# EAGLE design keyless (EAGLE 6.5.0)
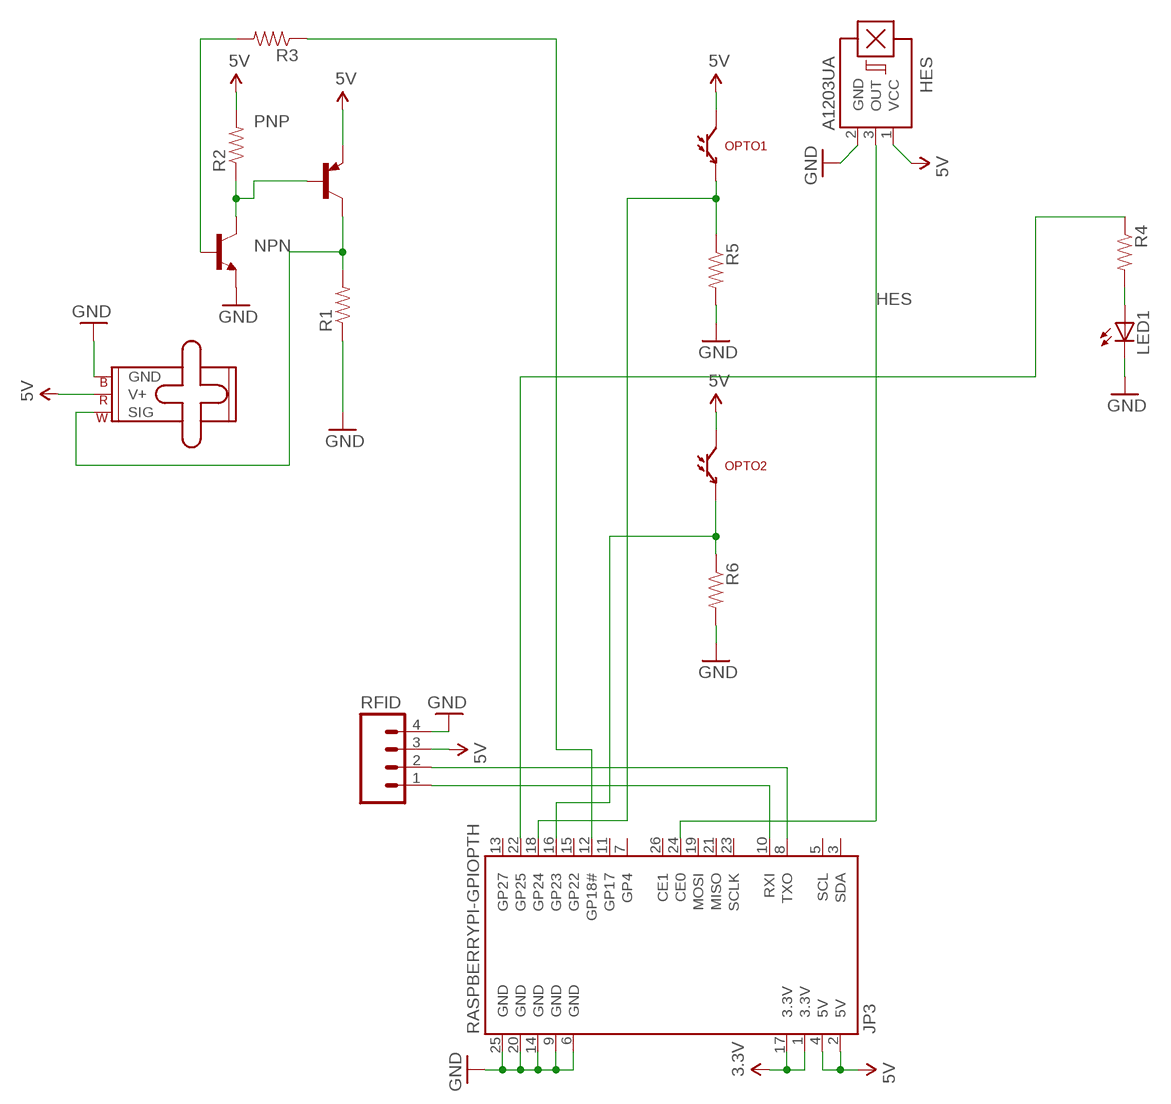
[diagram p0: schematic, sheet 1]

## Parts
HES  A1203UA  [SIP3-UA]
JP3  RASPBERRYPI-GPIOPTH  [2X13-SHROUDED]
LED1  LED5MM  [LED5MM]
NPN  TRANSISTOR_NPNTO-92-AMMO  [TO-92-AMMO]
OPTO1  LTR-301  [LTR-301]
OPTO2  LTR-301  [LTR-301]
PNP  -PNP-TO92-CEB  [TO92-CEB]
R1  RESISTORAXIAL-0.3  [AXIAL-0.3]
R2  RESISTORAXIAL-0.3  [AXIAL-0.3]
R3  RESISTORAXIAL-0.3  [AXIAL-0.3]
R4  RESISTORAXIAL-0.3  [AXIAL-0.3]
R5  RESISTORAXIAL-0.3  [AXIAL-0.3]
R6  RESISTORAXIAL-0.3  [AXIAL-0.3]
RFID  M04PTH  [1X04]
SERVO  SMALL_SERVO  [1X03]

## Nets
3.3V: JP3.1(3.3V) JP3.17(3.3V)
5V: HES.1(VCC) JP3.2(5V) JP3.4(5V) OPTO1.C OPTO2.C PNP.E R2.P$2 RFID.3 SERVO.2(V+)
GND: HES.2(GND) JP3.6(GND) JP3.9(GND) JP3.14(GND) JP3.20(GND) JP3.25(GND) LED1.K(C) NPN.1(E) R1.P$1 R5.P$2 R6.P$2 RFID.4
HES: HES.3(OUT) JP3.24(CE0)
N$1: NPN.3(C) PNP.B R2.P$1
N$2: JP3.12(GP18#) R3.P$1
N$3: PNP.C R1.P$2 SERVO.1(SIG)
N$4: NPN.2(B) R3.P$2
N$5: LED1.A R4.P$2
N$7: JP3.16(GP23) OPTO2.E R6.P$1
N$8: JP3.18(GP24) OPTO1.E R5.P$1
N$9: JP3.10(RXI) RFID.1
N$10: JP3.8(TXO) RFID.2
N$11: SERVO.3(GND)
N$13: JP3.22(GP25) R4.P$1
Unconnected: JP3.3(SDA) JP3.5(SCL) JP3.7(GP4) JP3.11(GP17) JP3.13(GP27) JP3.15(GP22) JP3.19(MOSI) JP3.21(MISO) JP3.23(SCLK) JP3.26(CE1)

## Library data of the parts
HES = allegro:A12*?: Hall-effect bipolar switch Source: http://www.allegromicro.com/en/Products/Part_Numbers/1202/1202.pdf; OC_FARNELL: 1521672; OC_NEWARK: unknown
JP3 = SparkFun-Boards:RASPBERRYPI-GPIO: RASPBERRY PI I/O HEADER As defined for the Revistion 2 Pi.; DIST: sparkfun; DIST_ID: PRT-11490
LED1 = led:LED: LED OSRAM: - CHIPLED LG R971, LG N971, LY N971, LG Q971, LY Q971, LO R971, LY R971 LH N974, LH R974 LS Q976, LO Q976, LY Q976 LO Q996 - Hyper CHIPLED LW Q18S LB Q993, LB Q99A, LB R99A - SideLED LS A670, LO A670, LY A670, LG A670, LP A670 LB A673, LV A673, LT A673, LW A673 LH A674 LY A675 LS A676, LA A676, LO A676, LY A676, LW A676 LS A679, LY A679, LG A679 - Hyper Micro SIDELED® LS Y876, LA Y876, LO Y876, LY Y876 LT Y87S - SmartLED LW L88C, LW L88S LB L89C, LB L89S, LG L890 LS L89K, LO L89K, LY L89K LS L896, LA L896, LO L896, LY L896 - TOPLED LS T670, LO T670, LY T670, LG T670, LP T670 LSG T670, LSP T670, LSY T670, LOP T670, LYG T670 LG T671, LOG T671, LSG T671 LB T673, LV T673, LT T673, LW T673 LH T674 LS T676, LA T676, LO T676, LY T676, LB T676, LH T676, LSB T676, LW T676 LB T67C, LV T67C, LT T67C, LS T67K, LO T67K, LY T67K, LW E67C LS E67B, LA E67B, LO E67B, LY E67B, LB E67C, LV E67C, LT E67C LW T67C LS T679, LY T679, LG T679 LS T770, LO T770, LY T770, LG T770, LP T770 LB T773, LV T773, LT T773, LW T773 LH T774 LS E675, LA E675, LY E675, LS T675 LS T776, LA T776, LO T776, LY T776, LB T776 LHGB T686 LT T68C, LB T68C - Hyper Mini TOPLED® LB M676 - Mini TOPLED Santana® LG M470 LS M47K, LO M47K, LY M47K Source: http://www.osram.convergy.de LUXEON: - LUMILED® LXK2-PW12-R00, LXK2-PW12-S00, LXK2-PW14-U00, LXK2-PW14-V00 LXK2-PM12-R00, LXK2-PM12-S00, LXK2-PM14-U00 LXK2-PE12-Q00, LXK2-PE12-R00, LXK2-PE12-S00, LXK2-PE14-T00, LXK2-PE14-U00 LXK2-PB12-K00, LXK2-PB12-L00, LXK2-PB12-M00, LXK2-PB14-N00, LXK2-PB14-P00, LXK2-PB14-Q00 LXK2-PR12-L00, LXK2-PR12-M00, LXK2-PR14-Q00, LXK2-PR14-R00 LXK2-PD12-Q00, LXK2-PD12-R00, LXK2-PD12-S00 LXK2-PH12-R00, LXK2-PH12-S00 LXK2-PL12-P00, LXK2-PL12-Q00, LXK2-PL12-R00 Source: www.luxeon.com KINGBRIGHT: KA-3528ASYC Source: www.kingbright.com
NPN = SparkFun-DiscreteSemi:TRANSISTOR_NPN: Generic NPN BJT MMBT2222A - TRANS-08049 (SOT-23, 1A 40V) MPSA42 - TRANS-09116 (SOT-23, 500mA 300V) MMBT5088LT1G - TRANS-11160 (SOT-23, 50 mA 30V)
OPTO1 OPTO2 = SparkFun-Sensors:LTR-301: Through-hole side-receiving IR phototransistor
PNP = transistor:*-PNP-: PNP Transistror
R1-R6 = SparkFun-Passives:RESISTOR: Resistor Basic schematic elements and footprints for 0603, 1206, and PTH resistors.
RFID = SparkFun-Connectors:M04: Header 4 Standard 4-pin 0.1" header. Use with straight break away headers (SKU : PRT-00116), right angle break away headers (PRT-00553), swiss pins (PRT-00743), machine pins (PRT-00117), and female headers (PRT-00115). Molex polarized connector foot print use with SKU : PRT-08231 with associated crimp pins and housings. 1MM SMD Version SKU: PRT-10208
SERVO = SparkFun-Electromechanical:SMALL_SERVO: Small servo motor This is the small servo used in the SIK. SKU: ROB-09065

## Board
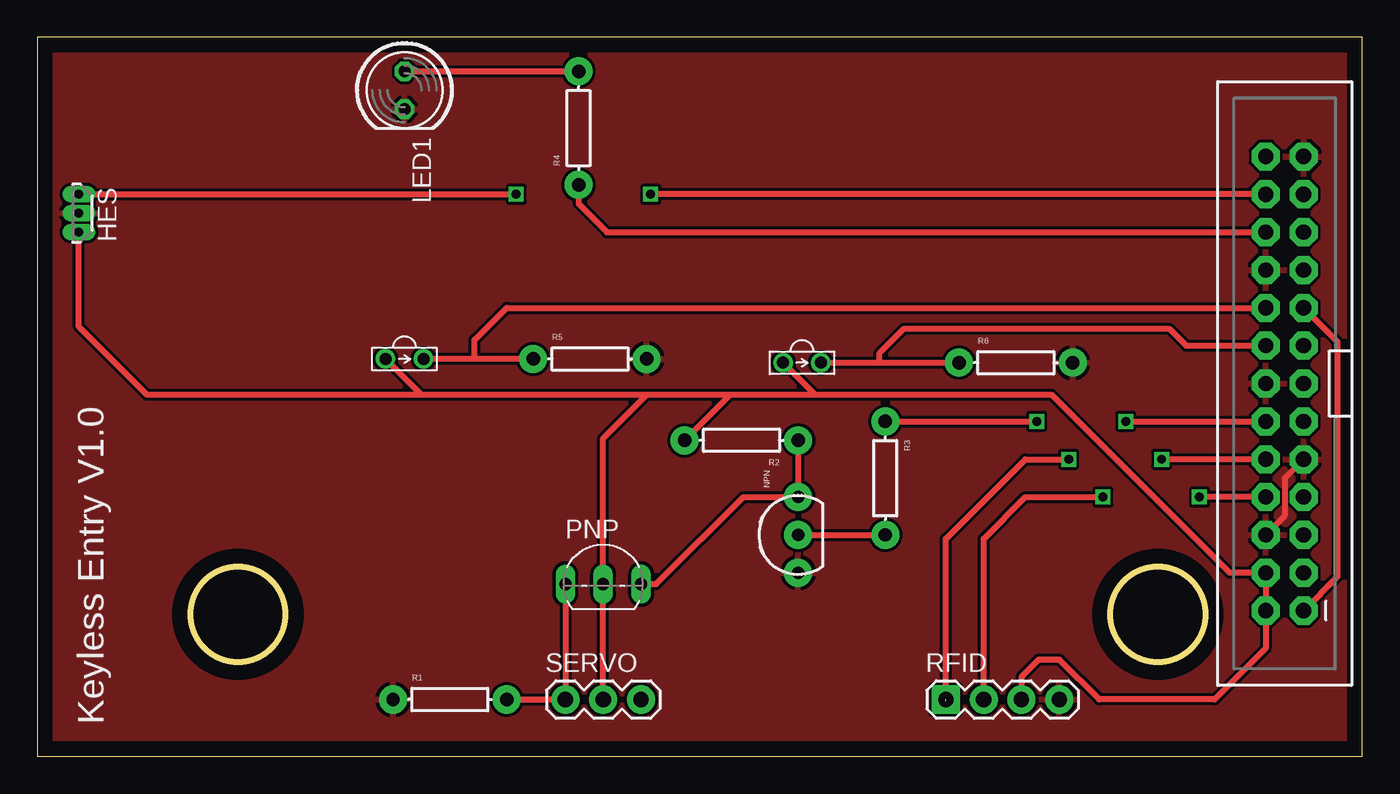
[diagram p1: board, top side]
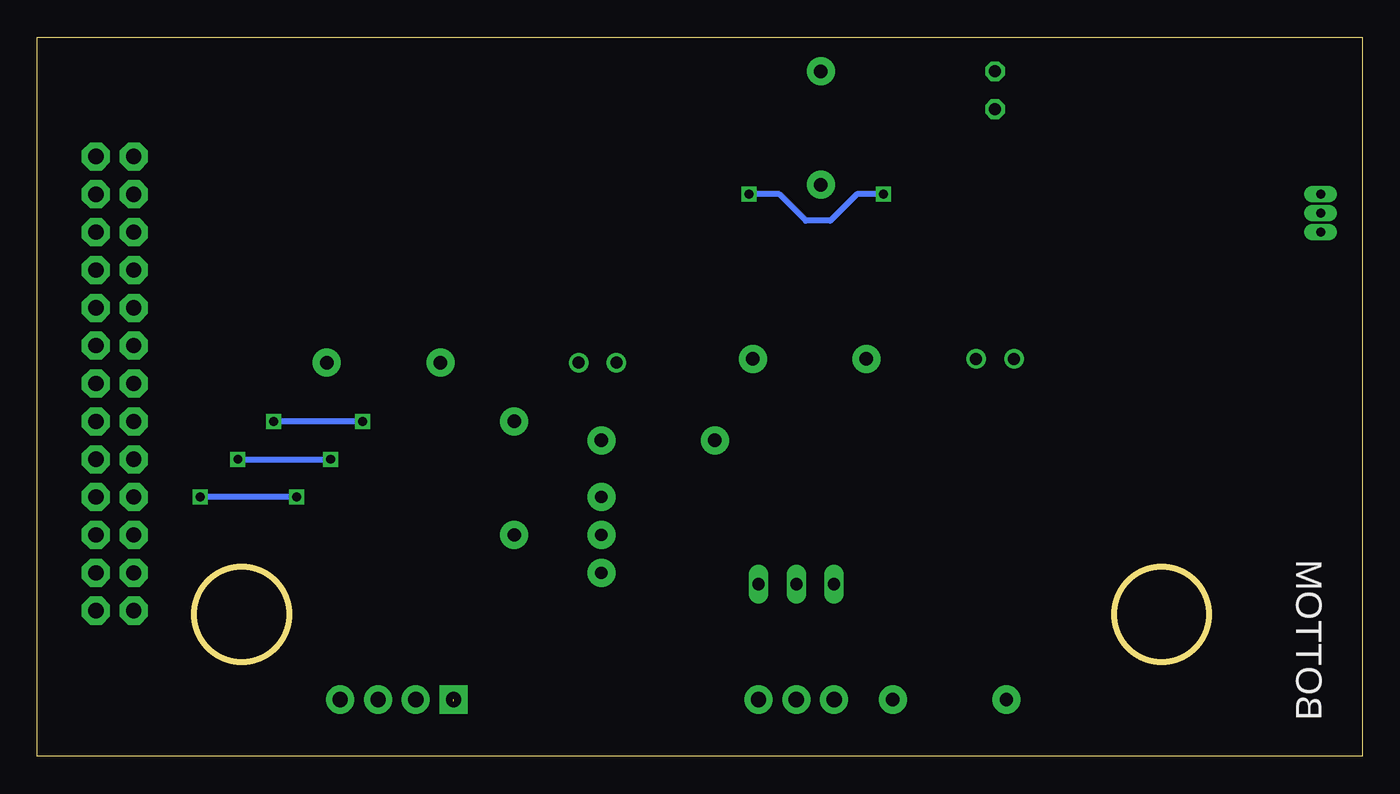
[diagram p2: board, bottom side, seen from below]

Size 88.9 x 48.26 mm. Coordinates in mm from the lower left corner, seen from the top.
Outline: 0,0 88.9,0 88.9,48.26 0,48.26 0,0
Outline: circle at 13.46,9.53 radius 3.17
Outline: circle at 75.18,9.53 radius 3.17
Copper layers (1*16): Top 0.035mm / dielectric 1.5mm / Bottom 0.035mm
Design rules "default": minimum track width 10mil, minimum drill 24mil, track to track 8mil, track to pad 8mil, pad to pad 8mil, via to via 8mil, smd to smd 8mil, copper to edge 40mil, drill to drill 8mil, minimum pad ring 10mil, minimum via ring 8mil, stop-mask expansion 4mil, vias tented up to drill 0mil, thermal gap 10mil

### Footprints (pad centres in the part's own frame; a part is rotated, then mirrored left to right if it is on the bottom)
SIP3-UA = drill 0.6 pad 0.7 long: 1 -1.27,0; 2 0,0; 3 1.27,0
2X13-SHROUDED = drill 1.016 pad 1.88 octagon: 1 -1.27,15.24; 2 1.27,15.24; 3 -1.27,12.7; 4 1.27,12.7; 5 -1.27,10.16; 6 1.27,10.16; 7 -1.27,7.62; 8 1.27,7.62; 9 -1.27,5.08; 10 1.27,5.08; 11 -1.27,2.54; 12 1.27,2.54; 13 -1.27,0; 14 1.27,0; 15 -1.27,-2.54; 16 1.27,-2.54; 17 -1.27,-5.08; 18 1.27,-5.08; 19 -1.27,-7.62; 20 1.27,-7.62; 21 -1.27,-10.16; 22 1.27,-10.16; 23 -1.27,-12.7; 24 1.27,-12.7; 25 -1.27,-15.24; 26 1.27,-15.24
LED5MM = drill 0.813 octagon: A -1.27,0; K 1.27,0
TO-92-AMMO = drill 0.813 pad 1.88: 1 -2.54,0; 2 0,0; 3 2.54,0
LTR-301 = drill 0.8: C 1.27,0; E -1.27,0
TO92-CEB = drill 0.813 long: B 2.54,0; C -2.54,0; E 0,0
AXIAL-0.3 = drill 0.9 pad 1.88: P$1 -3.81,0; P$2 3.81,0
1X04 = drill 1.016 pad 1.88 square: 1 0,0 | drill 1.016 pad 1.88: 2 2.54,0; 3 5.08,0; 4 7.62,0
1X03 = drill 1.016 pad 1.88: 1 0,0; 2 2.54,0; 3 5.08,0

### Placement (x,y rotation side)
HES  2.79,36.45 90 top
JP3  83.69,25.02 180 top
LED1  24.64,44.7 270 top
NPN  51.05,14.86 90 top
OPTO1  24.64,26.67 180 top
OPTO2  51.31,26.42 180 top
PNP  37.97,11.56 0 top
R1  27.69,3.81 0 top
R2  47.24,21.21 180 top
R3  56.9,18.67 270 top
R4  36.32,42.16 90 top
R5  37.08,26.67 0 top
R6  65.66,26.42 0 top
RFID  60.96,3.81 0 top
SERVO  35.43,3.81 0 top

### Tracks (layer width: path | path; a pad name or v marks a point on that pad's centre or on a via)
3.3V
  Top 0.406: JP3.1 87.25,12.06 87.25,27.81 JP3.17
5V
  Top 0.406: RFID.3 66.04,5.33 67.18,6.48 68.58,6.48 71.25,3.81 78.99,3.81 82.42,7.24 JP3.2 JP3.4 80.01,12.32 68.07,24.26 52.2,24.26 | 52.2,24.26 OPTO2.C | 52.2,24.26 46.48,24.26 | 46.48,24.26 40.89,24.26 | 40.89,24.26 25.78,24.26 | 25.78,24.26 OPTO1.C | R2.P$2 46.48,24.26 | 40.89,24.26 37.97,21.34 PNP.E SERVO.2 | 25.78,24.26 7.37,24.26 2.79,28.83 HES.1
GND
  Top 0.406: JP3.9 83.69,18.67 83.69,16.13 JP3.6
  pour Top: -4.7,50.8 -4.7,-5.33 96.01,-5.33 96.01,50.8
HES  (via drill 0.6)
  Top 0.406: HES.3 v32.13,37.72 | JP3.24 v41.15,37.72
  Bottom 0.406: v32.13,37.72 33.91,37.72 35.69,35.94 37.34,35.94 39.12,37.72 v41.15,37.72
N$1
  Top 0.406: R2.P$1 NPN.3 47.37,17.4 41.53,11.56 PNP.B
N$2  (via drill 0.6)
  Top 0.406: R3.P$1 v67.06,22.48 | v73.03,22.48 JP3.12
  Bottom 0.406: v67.06,22.48 v73.03,22.48
N$3
  Top 0.406: PNP.C SERVO.1 R1.P$2
N$4
  Top 0.406: NPN.2 R3.P$2
N$5
  Top 0.406: LED1.A R4.P$2
N$7
  Top 0.406: OPTO2.E 56.52,26.42 | 56.52,26.42 R6.P$1 | 56.52,26.42 56.52,27.05 58.17,28.7 75.95,28.7 77.09,27.56 JP3.16
N$8
  Top 0.406: R5.P$1 29.34,26.67 | 29.34,26.67 OPTO1.E | 29.34,26.67 29.34,27.94 31.5,30.1 JP3.18
N$9  (via drill 0.6)  (1 unrouted)
  Top 0.406: JP3.10 v75.44,19.94 | 60.96,3.68 60.96,14.61 66.29,19.94 v69.22,19.94
  Bottom 0.406: v75.44,19.94 v69.22,19.94
N$10  (via drill 0.6)
  Top 0.406: RFID.2 63.5,14.61 66.29,17.4 v71.5,17.4 | JP3.8 v77.98,17.4
  Bottom 0.406: v71.5,17.4 v77.98,17.4
N$13
  Top 0.406: R4.P$1 36.32,37.08 38.23,35.18 JP3.22

### Text on the board
_tsilk: Keyless Entry V1.0
_bsilk: BOTTOM